# EAGLE design sound-board (EAGLE 8.3.1)
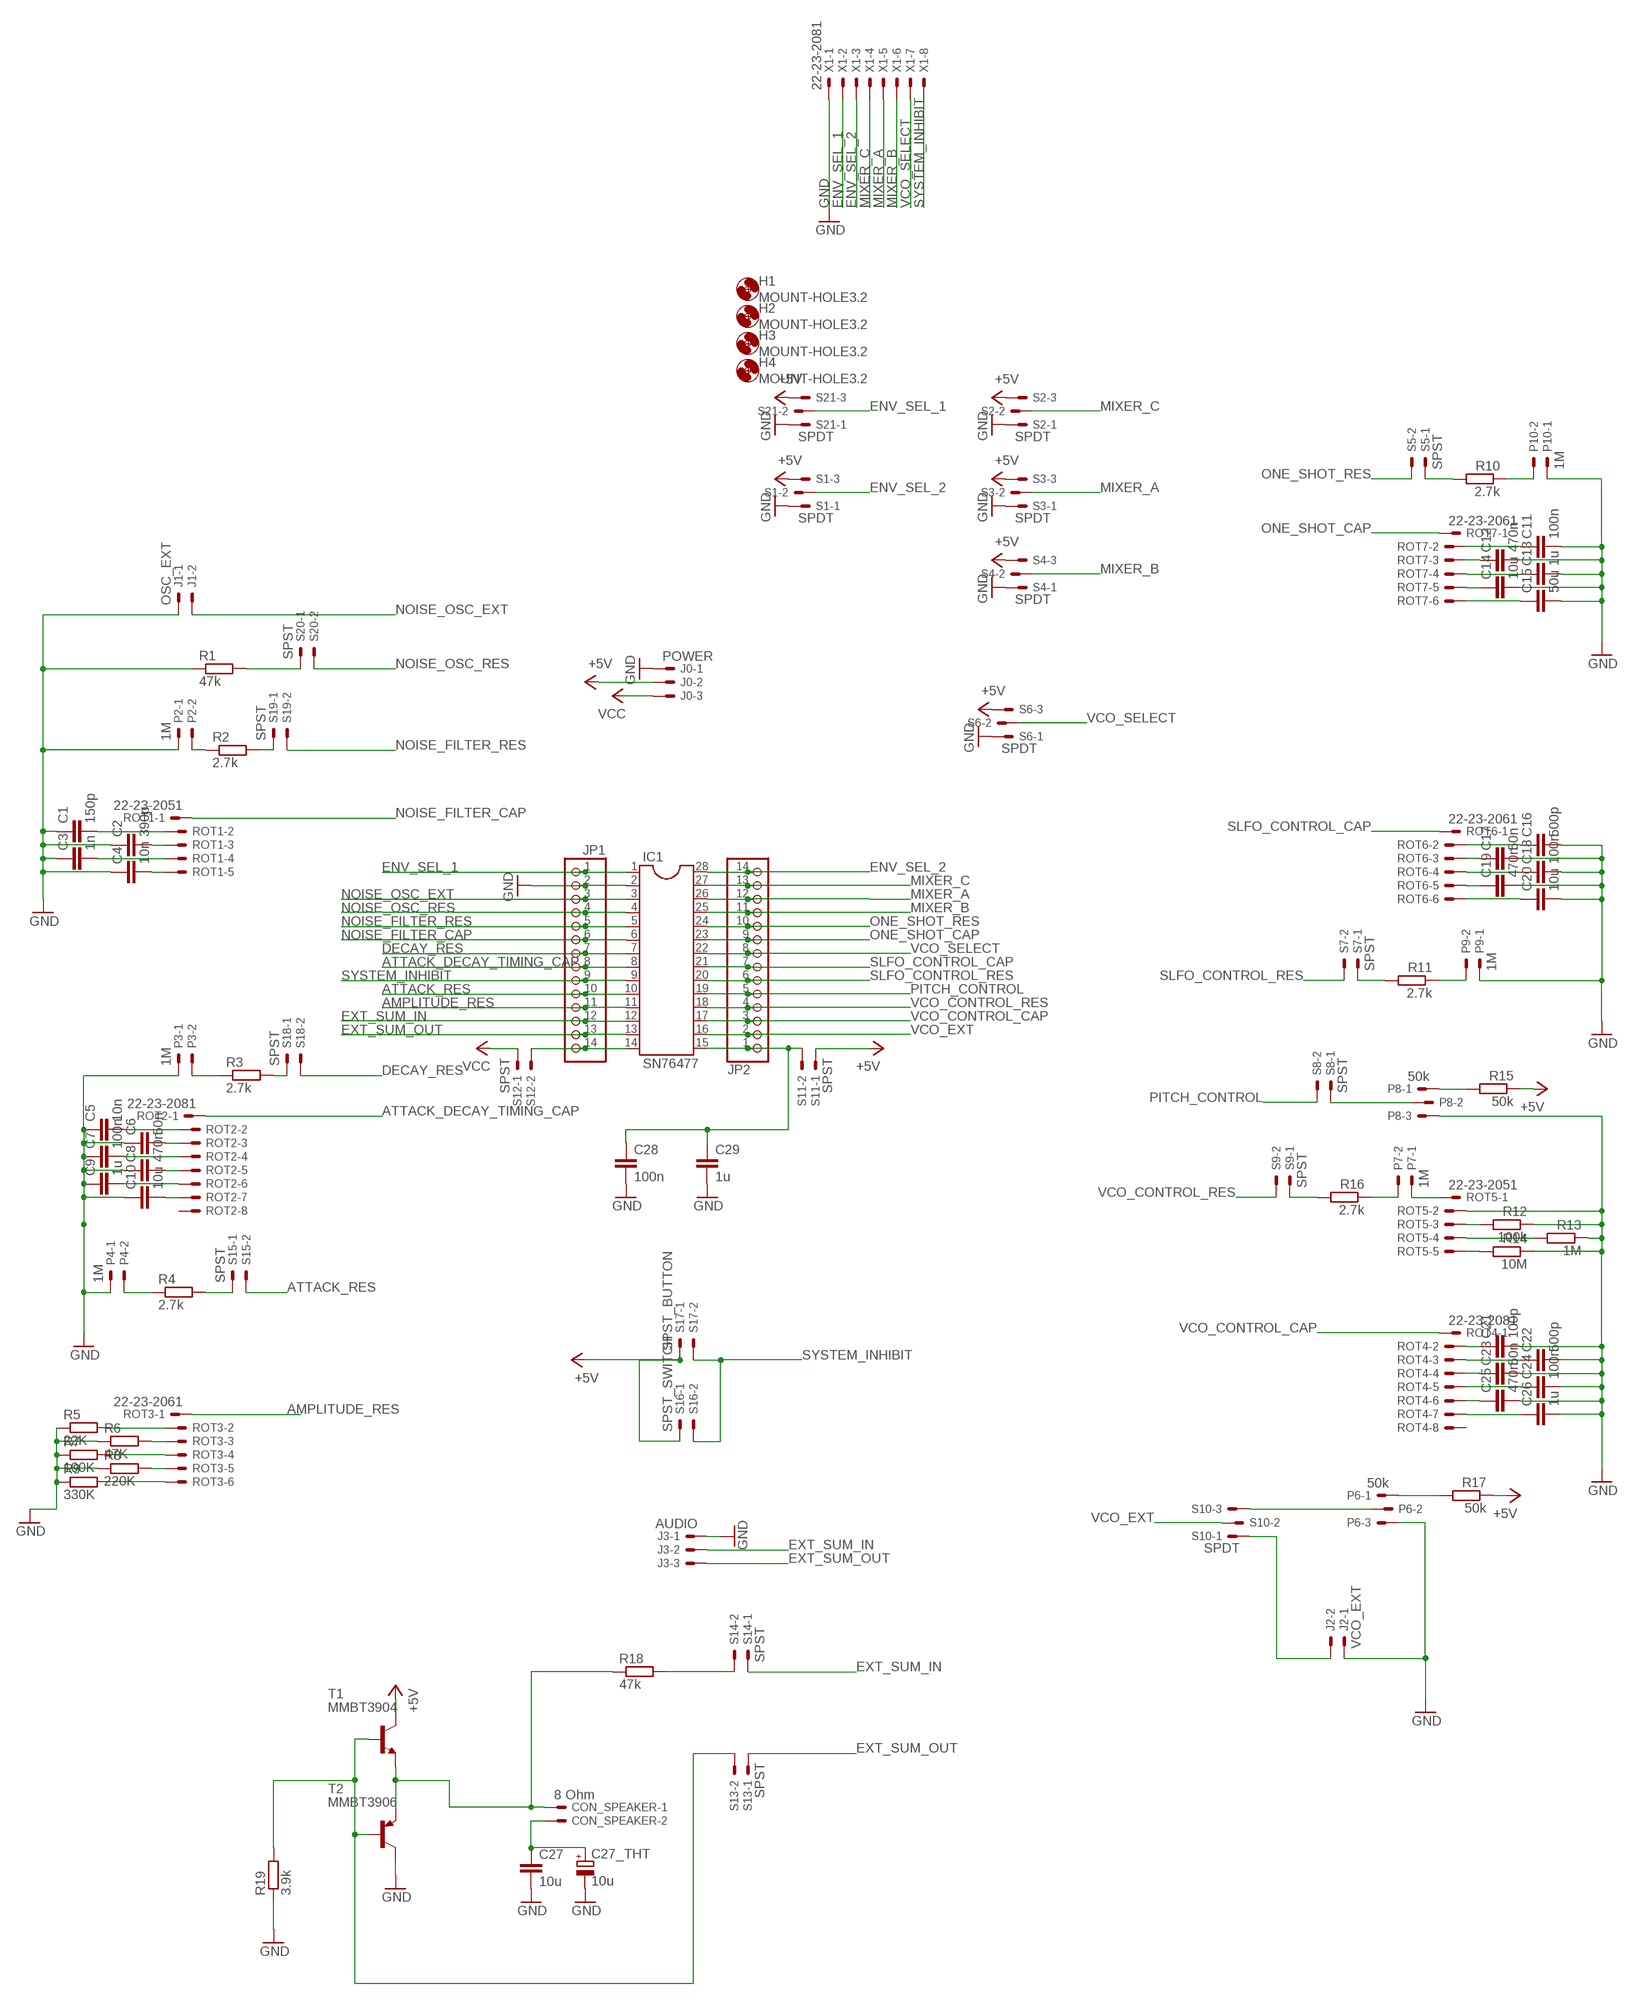
[diagram p0: schematic, sheet 1]

## Parts
C1  150p  C-EUC0805  [C0805]
C2  390p  C-EUC0805  [C0805]
C3  1n  C-EUC0805  [C0805]
C4  10n  C-EUC0805  [C0805]
C5  10n  C-EUC0805  [C0805]
C6  50n  C-EUC0805  [C0805]
C7  100n  C-EUC0805  [C0805]
C8  470n  C-EUC0805  [C0805]
C9  1u  C-EUC0805  [C0805]
C10  10u  C-EUC0805  [C0805]
C11  100n  C-EUC0805  [C0805]
C12  470n  C-EUC0805  [C0805]
C13  1u  C-EUC0805  [C0805]
C14  10u  C-EUC0805  [C0805]
C15  50u  C-EUC0805  [C0805]
C16  500p  C-EUC0805  [C0805]
C17  50n  C-EUC0805  [C0805]
C18  100n  C-EUC0805  [C0805]
C19  470n  C-EUC0805  [C0805]
C20  10u  C-EUC0805  [C0805]
C21  100p  C-EUC0805  [C0805]
C22  500p  C-EUC0805  [C0805]
C23  50n  C-EUC0805  [C0805]
C24  100n  C-EUC0805  [C0805]
C25  470n  C-EUC0805  [C0805]
C26  1u  C-EUC0805  [C0805]
C27  10u  C-EUC0805  [C0805]
C27_THT  10u  CPOL-EUE2.5-5  [E2,5-5]
C28  100n  C-EUC0805  [C0805]
C29  1u  C-EUC0805  [C0805]
CON_SPEAKER  8 Ohm  22-23-2021  [22-23-2021]
H1  MOUNT-HOLE3.2  [3,2]
H2  MOUNT-HOLE3.2  [3,2]
H3  MOUNT-HOLE3.2  [3,2]
H4  MOUNT-HOLE3.2  [3,2]
IC1  SN76477  DIL28  [DIL28-6]
J0  POWER  22-23-2031  [22-23-2031]
J1  OSC_EXT  22-23-2021  [22-23-2021]
J2  VCO_EXT  22-23-2021  [22-23-2021]
J3  AUDIO  22-23-2031  [22-23-2031]
JP1  PINHD-1X14  [1X14]
JP2  PINHD-1X14  [1X14]
P2  1M  22-23-2021  [22-23-2021]
P3  1M  22-23-2021  [22-23-2021]
P4  1M  22-23-2021  [22-23-2021]
P6  50k  22-23-2031  [22-23-2031]
P7  1M  22-23-2021  [22-23-2021]
P8  50k  22-23-2031  [22-23-2031]
P9  1M  22-23-2021  [22-23-2021]
P10  1M  22-23-2021  [22-23-2021]
R1  47k  R-EU_R0805  [R0805]
R2  2.7k  R-EU_R0805  [R0805]
R3  2.7k  R-EU_R0805  [R0805]
R4  2.7k  R-EU_R0805  [R0805]
R5  22K  R-EU_R0805  [R0805]
R6  47K  R-EU_R0805  [R0805]
R7  100K  R-EU_R0805  [R0805]
R8  220K  R-EU_R0805  [R0805]
R9  330K  R-EU_R0805  [R0805]
R10  2.7k  R-EU_R0805  [R0805]
R11  2.7k  R-EU_R0805  [R0805]
R12  100k  R-EU_R0805  [R0805]
R13  1M  R-EU_R0805  [R0805]
R14  10M  R-EU_R0805  [R0805]
R15  50k  R-EU_R0805  [R0805]
R16  2.7k  R-EU_R0805  [R0805]
R17  50k  R-EU_R0805  [R0805]
R18  47k  R-EU_R0805  [R0805]
R19  3.9k  R-EU_R0805  [R0805]
ROT1  22-23-2051  [22-23-2051]
ROT2  22-23-2081  [22-23-2081]
ROT3  22-23-2061  [22-23-2061]
ROT4  22-23-2081  [22-23-2081]
ROT5  22-23-2051  [22-23-2051]
ROT6  22-23-2061  [22-23-2061]
ROT7  22-23-2061  [22-23-2061]
S1  SPDT  22-23-2031  [22-23-2031]
S2  SPDT  22-23-2031  [22-23-2031]
S3  SPDT  22-23-2031  [22-23-2031]
S4  SPDT  22-23-2031  [22-23-2031]
S5  SPST  22-23-2021  [22-23-2021]
S6  SPDT  22-23-2031  [22-23-2031]
S7  SPST  22-23-2021  [22-23-2021]
S8  SPST  22-23-2021  [22-23-2021]
S9  SPST  22-23-2021  [22-23-2021]
S10  SPDT  22-23-2031  [22-23-2031]
S11  SPST  22-23-2021  [22-23-2021]
S12  SPST  22-23-2021  [22-23-2021]
S13  SPST  22-23-2021  [22-23-2021]
S14  SPST  22-23-2021  [22-23-2021]
S15  SPST  22-23-2021  [22-23-2021]
S16  SPST_SWITCH  22-23-2021  [22-23-2021]
S17  SPST_BUTTON  22-23-2021  [22-23-2021]
S18  SPST  22-23-2021  [22-23-2021]
S19  SPST  22-23-2021  [22-23-2021]
S20  SPST  22-23-2021  [22-23-2021]
S21  SPDT  22-23-2031  [22-23-2031]
T1  MMBT3904  MMBT3904LT1-NPN-SOT23-BEC  [SOT23-BEC]
T2  MMBT3906  MMBT3906LT1-PNP-SOT23-BEC  [SOT23-BEC]
X1  22-23-2081  [22-23-2081]

## Nets
+5V: J0.2 R15.1 R17.1 S1.3 S2.3 S3.3 S4.3 S6.3 S11.1 S16.1 S17.1 S21.3 T1.C
AMPLITUDE_RES: IC1.11 JP1.11 ROT3.1
ATTACK_DECAY_TIMING_CAP: IC1.8 JP1.8 ROT2.1
ATTACK_RES: IC1.10 JP1.10 S15.2
BASE: R19.2 S13.2 T1.B T2.B
DECAY_RES: IC1.7 JP1.7 S18.2
EMITTER: CON_SPEAKER.1 R18.1 T1.E T2.E
ENV_SEL_1: IC1.1 JP1.1 S21.2 X1.2
ENV_SEL_2: IC1.28 JP2.14 S1.2 X1.3
EXT_SUM_IN: IC1.12 J3.2 JP1.12 S14.1
EXT_SUM_OUT: IC1.13 J3.3 JP1.13 S13.1
GND: C1.1 C2.1 C3.1 C4.1 C5.1 C6.1 C7.1 C8.1 C9.1 C10.1 C11.2 C12.2 C13.2 C14.2 C15.2 C16.2 C17.2 C18.2 C19.2 C20.2 C21.2 C22.2 C23.2 C24.2 C25.2 C26.2 C27.2 C27_THT.- C28.2 C29.2 IC1.2 J0.1 J1.1 J2.1 J3.1 JP1.2 P2.1 P3.1 P4.1 P6.3 P8.3 P9.1 P10.1 R1.1 R5.1 R6.1 R7.1 R8.1 R9.1 R12.1 R13.1 R14.1 R19.1 ROT5.2 S1.1 S2.1 S3.1 S4.1 S6.1 S21.1 T2.C X1.1
MIXER_A: IC1.26 JP2.12 S3.2 X1.5
MIXER_B: IC1.25 JP2.11 S4.2 X1.6
MIXER_C: IC1.27 JP2.13 S2.2 X1.4
N$1: P10.2 R10.1
N$2: R2.2 S19.1
N$3: P3.2 R3.1
N$4: P2.2 R2.1
N$5: R1.2 S20.1
N$6: R5.2 ROT3.2
N$7: R6.2 ROT3.3
N$8: R7.2 ROT3.4
N$9: R8.2 ROT3.5
N$10: R10.2 S5.1
N$11: C16.1 ROT6.2
N$13: C27.1 C27_THT.+ CON_SPEAKER.2
N$14: IC1.14 JP1.14 S12.2
N$15: C11.1 ROT7.2
N$16: C13.1 ROT7.4
N$17: C15.1 ROT7.6
N$18: C14.1 ROT7.5
N$19: C18.1 ROT6.4
N$20: C20.1 ROT6.6
N$22: P9.2 R11.1
N$23: R12.2 ROT5.3
N$24: R14.2 ROT5.5
N$25: R13.2 ROT5.4
N$26: J2.2 S10.1
N$27: C21.1 ROT4.2
N$29: R9.2 ROT3.6
N$30: C1.2 ROT1.2
N$31: C2.2 ROT1.3
N$32: C3.2 ROT1.4
N$33: C4.2 ROT1.5
N$34: C5.2 ROT2.2
N$35: C6.2 ROT2.3
N$36: C7.2 ROT2.4
N$37: C8.2 ROT2.5
N$38: C9.2 ROT2.6
N$39: C10.2 ROT2.7
N$40: R3.2 S18.1
N$41: P4.2 R4.1
N$42: R4.2 S15.1
N$43: C12.1 ROT7.3
N$44: C19.1 ROT6.5
N$45: C17.1 ROT6.3
N$46: R11.2 S7.1
N$47: C23.1 ROT4.4
N$48: C25.1 ROT4.6
N$49: C26.1 ROT4.7
N$50: C24.1 ROT4.5
N$51: C22.1 ROT4.3
N$52: P8.2 S8.1
N$53: P8.1 R15.2
N$54: P7.2 R16.1
N$55: R16.2 S9.1
N$56: P7.1 ROT5.1
N$57: P6.2 S10.3
N$58: P6.1 R17.2
N$60: R18.2 S14.2
NOISE_FILTER_CAP: IC1.6 JP1.6 ROT1.1
NOISE_FILTER_RES: IC1.5 JP1.5 S19.2
NOISE_OSC_EXT: IC1.3 J1.2 JP1.3
NOISE_OSC_RES: IC1.4 JP1.4 S20.2
ONE_SHOT_CAP: IC1.23 JP2.9 ROT7.1
ONE_SHOT_RES: IC1.24 JP2.10 S5.2
PITCH_CONTROL: IC1.19 JP2.5 S8.2
SLFO_CONTROL_CAP: IC1.21 JP2.7 ROT6.1
SLFO_CONTROL_RES: IC1.20 JP2.6 S7.2
SYSTEM_INHIBIT: IC1.9 JP1.9 S16.2 S17.2 X1.8
VCC: J0.3 S12.1
VCO_CONTROL_CAP: IC1.17 JP2.3 ROT4.1
VCO_CONTROL_RES: IC1.18 JP2.4 S9.2
VCO_EXT: IC1.16 JP2.2 S10.2
VCO_SELECT: IC1.22 JP2.8 S6.2 X1.7
VREG: C28.1 C29.1 IC1.15 JP2.1 S11.2
Unconnected: ROT2.8 ROT4.8

## Library data of the parts
C1-C29 = rcl:C-EU: CAPACITOR, European symbol
C27_THT = rcl:CPOL-EU: POLARIZED CAPACITOR, European symbol
CON_SPEAKER J1 J2 P2-P4 P7 P9 P10 S5 S7-S9 S11-S20 = con-molex:22-23-2021: .100" (2.54mm) Center Header - 2 Pin; MF: MOLEX; MPN: 22-23-2021; OC_FARNELL: 1462926; OC_NEWARK: 25C3832
H1-H4 = holes:MOUNT-HOLE: MOUNTING HOLE with drill center marker
IC1 = ic-package:DIL28: Dual In Line
J0 J3 P6 P8 S1-S4 S6 S10 S21 = con-molex:22-23-2031: .100" (2.54mm) Center Header - 3 Pin; MF: MOLEX; MPN: 22-23-2031; OC_FARNELL: 1462950; OC_NEWARK: 30C0862
JP1 JP2 = pinhead:PINHD-1X14: PIN HEADER
R1-R19 = rcl:R-EU_: RESISTOR, European symbol
ROT1 ROT5 = con-molex:22-23-2051: .100" (2.54mm) Center Header - 5 Pin; MF: MOLEX; MPN: 22-23-2051; OC_FARNELL: 1462952; OC_NEWARK: 38C9178
ROT2 ROT4 X1 = con-molex:22-23-2081: .100" (2.54mm) Center Header - 8 Pin; MF: MOLEX; MPN: 22-23-2081; OC_FARNELL: 1756826; OC_NEWARK: 01C7592
ROT3 ROT6 ROT7 = con-molex:22-23-2061: .100" (2.54mm) Center Header - 6 Pin; MF: MOLEX; MPN: 22-23-2061; OC_FARNELL: 1462922; OC_NEWARK: 27C1933
T1 = transistor:*-NPN-: NPN Transistror BF959 corrected 2008.03.06
T2 = transistor:*-PNP-: PNP Transistror

## Module NOISE
Ports: NOISE_EXT_OSC(io) NOISE_OSC_RES(io) NOISE_FILTER_RES(io) NOISE_FILTER_CAP(io) GND(io)

### Library data of the parts

## Board
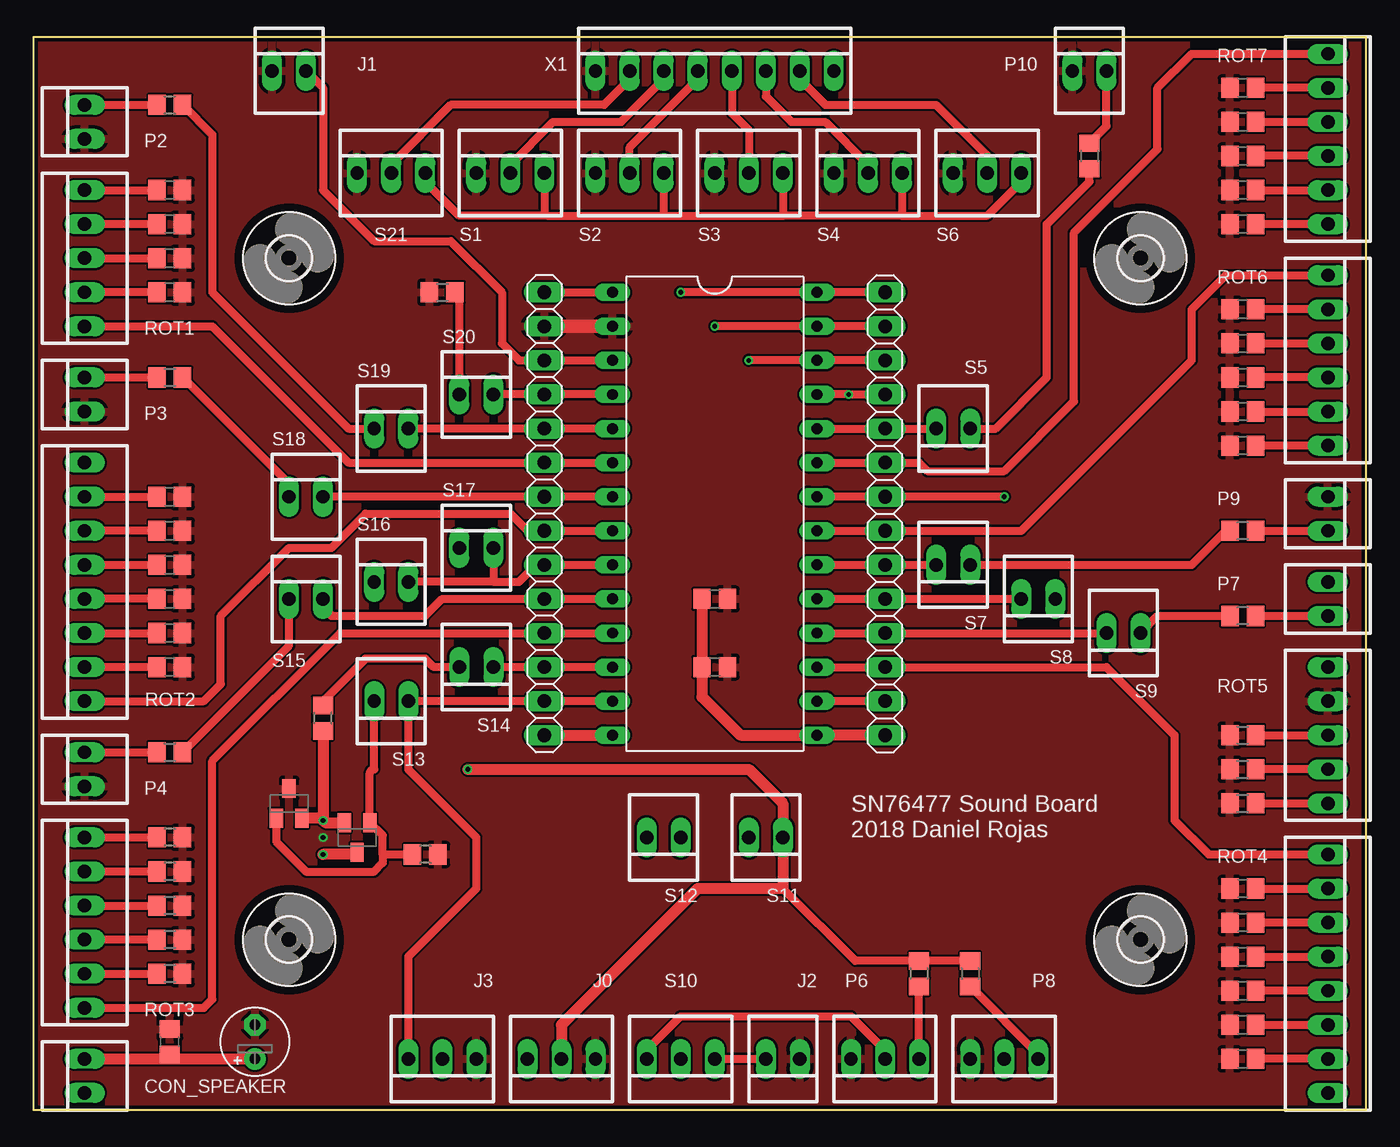
[diagram p1: board, top side]
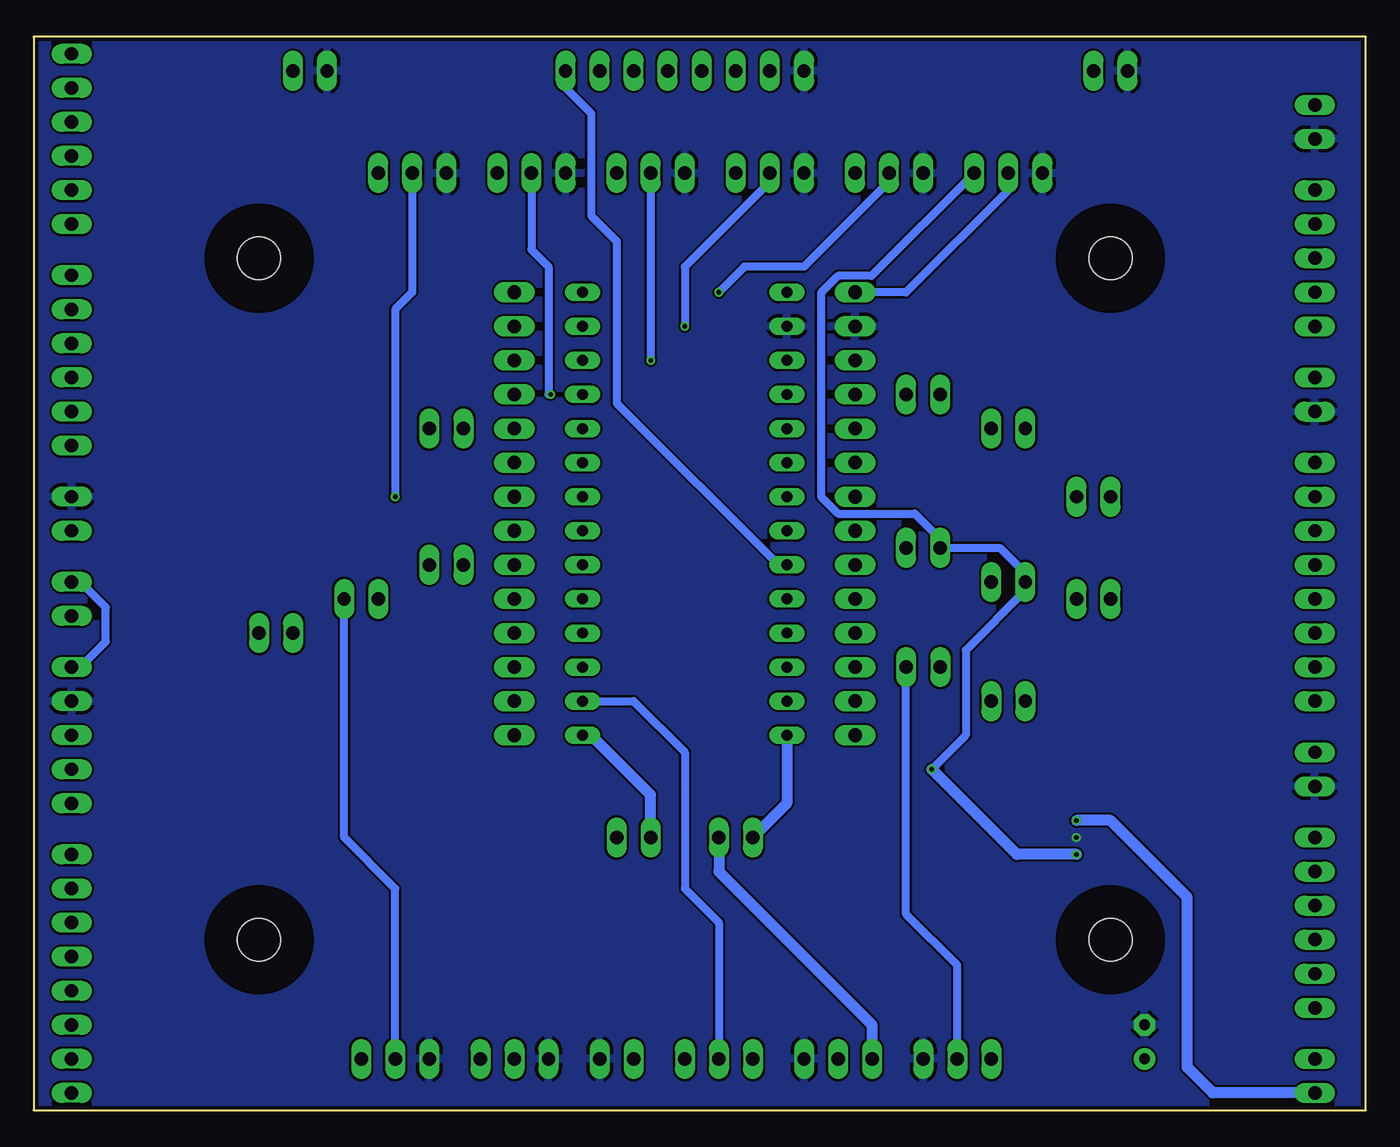
[diagram p2: board, bottom side, seen from below]

Size 99.36 x 80 mm. Coordinates in mm from the lower left corner, seen from the top.
Outline: 0,0 0,80 99.36,80 99.36,0 0,0
Copper layers (1*16): Top 0.035mm / dielectric 1.5mm / Bottom 0.035mm
Design rules "ITEADstudio_DRC": minimum track width 6mil, minimum drill 12mil, track to track 6mil, track to pad 6mil, pad to pad 6mil, via to via 6mil, smd to smd 0mil, copper to edge 10mil, drill to drill 10mil, minimum pad ring 10mil, minimum via ring 6mil, stop-mask expansion 2mil, vias tented up to drill 100mil, thermal gap 10mil

### Footprints (pad centres in the part's own frame; a part is rotated, then mirrored left to right if it is on the bottom)
C0805 = smd 1.3 x 1.5: 1 -0.95,0; 2 0.95,0
E2,5-5 = drill 0.813 pad 1.6: + -1.27,0 | drill 0.813 pad 1.6 octagon: - 1.27,0
22-23-2021 = drill 1 long: 1 -1.27,0; 2 1.27,0
3,2 = hole 3.2: 0,0
DIL28-6 = drill 0.813 long: 1 -16.51,-7.62; 2 -13.97,-7.62; 3 -11.43,-7.62; 4 -8.89,-7.62; 5 -6.35,-7.62; 6 -3.81,-7.62; 7 -1.27,-7.62; 8 1.27,-7.62; 9 3.81,-7.62; 10 6.35,-7.62; 11 8.89,-7.62; 12 11.43,-7.62; 13 13.97,-7.62; 14 16.51,-7.62; 15 16.51,7.62; 16 13.97,7.62; 17 11.43,7.62; 18 8.89,7.62; 19 6.35,7.62; 20 3.81,7.62; 21 1.27,7.62; 22 -1.27,7.62; 23 -3.81,7.62; 24 -6.35,7.62; 25 -8.89,7.62; 26 -11.43,7.62; 27 -13.97,7.62; 28 -16.51,7.62
22-23-2031 = drill 1 long: 1 -2.54,0; 2 0,0; 3 2.54,0
1X14 = drill 1.016 long: 1 -16.51,0; 2 -13.97,0; 3 -11.43,0; 4 -8.89,0; 5 -6.35,0; 6 -3.81,0; 7 -1.27,0; 8 1.27,0; 9 3.81,0; 10 6.35,0; 11 8.89,0; 12 11.43,0; 13 13.97,0; 14 16.51,0
R0805 = smd 1.3 x 1.5: 1 -0.95,0; 2 0.95,0
22-23-2051 = drill 1 long: 1 -5.08,0; 2 -2.54,0; 3 0,0; 4 2.54,0; 5 5.08,0
22-23-2081 = drill 1 long: 1 -8.89,0; 2 -6.35,0; 3 -3.81,0; 4 -1.27,0; 5 1.27,0; 6 3.81,0; 7 6.35,0; 8 8.89,0
22-23-2061 = drill 1 long: 1 -6.35,0; 2 -3.81,0; 3 -1.27,0; 4 1.27,0; 5 3.81,0; 6 6.35,0
SOT23-BEC = smd 1 x 1.4: B -0.95,-1.1; C 0,1.1; E 0.95,-1.1

### Placement (x,y rotation side)
C1  10.16,60.96 180 top
C2  10.16,63.5 180 top
C3  10.16,66.04 180 top
C4  10.16,68.58 180 top
C5  10.16,33.02 180 top
C6  10.16,35.56 180 top
C7  10.16,38.1 180 top
C8  10.16,40.64 180 top
C9  10.16,43.18 180 top
C10  10.16,45.72 180 top
C11  90.17,76.2 180 top
C12  90.17,73.66 180 top
C13  90.17,71.12 180 top
C14  90.17,68.58 180 top
C15  90.17,66.04 180 top
C16  90.17,59.69 180 top
C17  90.17,57.15 180 top
C18  90.17,54.61 180 top
C19  90.17,52.07 180 top
C20  90.17,49.53 180 top
C21  90.17,16.51 180 top
C22  90.17,13.97 180 top
C23  90.17,11.43 180 top
C24  90.17,8.89 180 top
C25  90.17,6.35 180 top
C26  90.17,3.81 180 top
C27  10.16,5.08 90 top
C27_THT  16.51,5.08 90 top
C28  50.8,38.1 0 top
C29  50.8,33.02 0 top
CON_SPEAKER  3.81,2.54 90 top
H1  19.05,63.5 0 top
H2  82.55,63.5 0 top
H3  19.05,12.7 0 top
H4  82.55,12.7 0 top
IC1  50.8,44.45 270 top
J0  39.37,3.81 180 top
J1  19.05,77.47 0 top
J2  55.88,3.81 180 top
J3  30.48,3.81 180 top
JP1  38.1,44.45 270 top
JP2  63.5,44.45 90 top
P2  3.81,73.66 90 top
P3  3.81,53.34 90 top
P4  3.81,25.4 90 top
P6  63.5,3.81 180 top
P7  96.52,38.1 270 top
P8  72.39,3.81 180 top
P9  96.52,44.45 270 top
P10  78.74,77.47 0 top
R1  30.48,60.96 0 top
R2  10.16,74.93 0 top
R3  10.16,54.61 0 top
R4  10.16,26.67 0 top
R5  10.16,10.16 180 top
R6  10.16,12.7 180 top
R7  10.16,15.24 180 top
R8  10.16,17.78 180 top
R9  10.16,20.32 180 top
R10  78.74,71.12 270 top
R11  90.17,43.18 180 top
R12  90.17,27.94 0 top
R13  90.17,25.4 0 top
R14  90.17,22.86 0 top
R15  69.85,10.16 270 top
R16  90.17,36.83 180 top
R17  66.04,10.16 270 top
R18  21.59,29.21 90 top
R19  29.21,19.05 180 top
ROT1  3.81,63.5 90 top
ROT2  3.81,39.37 90 top
ROT3  3.81,13.97 90 top
ROT4  96.52,10.16 270 top
ROT5  96.52,27.94 270 top
ROT6  96.52,55.88 270 top
ROT7  96.52,72.39 270 top
S1  35.56,69.85 0 top
S2  44.45,69.85 0 top
S3  53.34,69.85 0 top
S4  62.23,69.85 0 top
S5  68.58,50.8 180 top
S6  71.12,69.85 0 top
S7  68.58,40.64 180 top
S8  74.93,38.1 180 top
S9  81.28,35.56 180 top
S10  48.26,3.81 180 top
S11  54.61,20.32 180 top
S12  46.99,20.32 180 top
S13  26.67,30.48 180 top
S14  33.02,33.02 180 top
S15  20.32,38.1 0 top
S16  26.67,39.37 0 top
S17  33.02,41.91 0 top
S18  20.32,45.72 0 top
S19  26.67,50.8 0 top
S20  33.02,53.34 0 top
S21  26.67,69.85 0 top
T1  24.13,20.32 180 top
T2  19.05,22.86 0 top
X1  50.8,77.47 0 top

### Tracks (layer width: path | path; a pad name or v marks a point on that pad's centre or on a via)
+5V  (via drill 0.35)
  Top 0.61: S21.3 29.21,69.22 31.75,66.67 38.29,66.67 | 47.12,66.67 55.98,66.67 | 38.29,66.67 47.12,66.67 | 64.77,69.22 S4.3 64.77,66.75 64.7,66.67 | S3.3 55.88,66.78 55.98,66.67 | S2.3 46.99,66.81 47.12,66.67 | S1.3 38.1,66.87 38.29,66.67 | S6.3 73.66,69.22 71.12,66.67 64.7,66.67 | 64.7,66.67 55.98,66.67 | R15.1 R17.1 61.28,11.11 55.88,16.51 | T1.C 23.96,19.05
  Top 0.813: v32.38,25.4 53.34,25.4 55.88,22.86 S11.1 55.88,16.51 49.53,16.51 39.37,6.35 J0.2 | 23.96,19.05 v21.59,19.05
  Bottom 0.61: v32.38,25.4 29.84,27.94 29.84,34.29 25.4,38.73 S16.1 25.4,40.01 27.3,41.91 S17.1 31.75,42.55 33.66,44.45 39.37,44.45 40.64,45.72 40.64,60.91 39.37,62.18 36.88,62.18 S21.3
  Bottom 0.813: v21.59,19.05 26.04,19.05 v32.38,25.4
AMPLITUDE_RES
  Top 0.61: IC1.11 JP1.11 22.86,35.56 13.34,26.04 13.34,8.26 12.7,7.62 ROT3.1
ATTACK_DECAY_TIMING_CAP
  Top 0.61: IC1.8 JP1.8 36.83,43.18 35.56,44.45 24.77,44.45 22.23,41.91 19.05,41.91 13.97,36.83 13.97,31.75 12.7,30.48 ROT2.1
ATTACK_RES
  Top 0.61: 38.35,38.1 IC1.10 | 38.35,38.1 JP1.10 | S15.2 21.59,37.47 22.23,36.83 29.21,36.83 30.48,38.1 38.35,38.1
BASE
  Top 0.61: 18.1,21.91 T2.B 18.1,20 20.32,17.78 25.4,17.78 26.04,18.41 26.04,19.03 | S13.2 25.4,25.4 arc90 25.08,25.08 T1.B 26.04,20.46 26.04,19.03 | R19.2 28.24,19.03 26.04,19.03
DECAY_RES
  Top 0.61: IC1.7 JP1.7 S18.2
EMITTER  (via drill 0.35)
  Top 0.61: v21.59,21.59 21.76,21.42
  Top 0.813: T2.E 21.42,21.76 v21.59,21.59 R18.1 | 21.76,21.42 T1.E
  Bottom 0.813: CON_SPEAKER.1 11.43,1.27 13.34,3.17 13.34,15.88 19.05,21.59 v21.59,21.59
ENV_SEL_1
  Top 0.61: JP1.1 IC1.1 | X1.2 44.45,76.83 42.55,74.93 31.11,74.93 26.67,70.48 S21.2 26.67,69.22
  Bottom 0.61: S21.2 26.67,68.58 34.29,60.96 JP1.1
ENV_SEL_2  (via drill 0.35)
  Top 0.61: JP2.14 IC1.28 v48.26,60.96 | X1.3 46.99,76.83 43.81,73.66 38.73,73.66 35.56,70.48 S1.2 35.56,69.22
  Bottom 0.61: S1.2 35.56,69.22 41.91,62.87 46.35,62.87 v48.26,60.96
EXT_SUM_IN
  Top 0.61: IC1.12 JP1.12 S14.1
  Bottom 0.61: J3.2 30.48,10.79 34.29,14.61 S14.1
EXT_SUM_OUT
  Top 0.61: IC1.13 JP1.13 S13.1 27.94,25.4 33.02,20.32 33.02,16.51 27.94,11.43 J3.3
GND  (via drill 0.35)
  Top 1.016: IC1.2 JP1.2
  other vias: 21.59,20.32
  pour Top: 0,0 0,80.01 100.33,80.01 101.6,0
  pour Bottom: 0,0 0,80.01 100.33,80.01 99.06,0
MIXER_A  (via drill 0.35)
  Top 0.61: JP2.12 IC1.26 v53.34,55.88 | S3.2 53.34,73.03 52.07,74.3 X1.5
  Bottom 0.61: S3.2 v53.34,55.88
MIXER_B  (via drill 0.35)
  Top 0.61: JP2.11 v60.79,53.34 IC1.25 | S4.2 62.23,70.48 59.05,73.66 56.52,73.66 54.61,75.56 X1.6
  Bottom 0.61: S4.2 62.23,64.14 60.96,62.87 60.96,53.34 v60.79,53.34
MIXER_C  (via drill 0.35)
  Top 0.61: JP2.13 IC1.27 v50.8,58.42 | X1.4 49.53,76.83 44.45,71.75 S2.2
  Bottom 0.61: S2.2 arc29 44.45,69.22 50.8,62.87 v50.8,58.42
N$1
  Top 0.61: R10.1 80.01,73.34 P10.2
N$2
  Top 0.61: R2.2 13.34,72.7 13.34,60.96 23.5,50.8 S19.1
N$3
  Top 0.61: P3.2 R3.1
N$4
  Top 0.61: P2.2 R2.1
N$5
  Top 0.61: S20.1 31.75,60.96 R1.2
N$6
  Top 0.61: ROT3.2 R5.2
N$7
  Top 0.61: R6.2 ROT3.3
N$8
  Top 0.61: ROT3.4 R7.2
N$9
  Top 0.61: R8.2 ROT3.5
N$10
  Top 0.61: S5.1 71.75,50.8 75.56,54.61 75.56,66.04 78.74,69.22 R10.2
N$11
  Top 0.61: ROT6.2 C16.1
N$13
  Top 0.813: CON_SPEAKER.2 8.89,3.81 | 8.89,3.81 9.84,3.81 C27.1 | 8.89,3.81 C27_THT.+
N$14
  Top 0.813: JP1.14 IC1.14
  Bottom 0.813: IC1.14 43.18,22.86 S12.2
N$15
  Top 0.61: ROT7.2 C11.1
N$16
  Top 0.61: ROT7.4 C13.1
N$17
  Top 0.61: ROT7.6 C15.1
N$18
  Top 0.61: C14.1 ROT7.5
N$19
  Top 0.61: ROT6.4 C18.1
N$20
  Top 0.61: ROT6.6 C20.1
N$22
  Top 0.61: R11.1 P9.2
N$23
  Top 0.61: R12.2 ROT5.3
N$24
  Top 0.61: R14.2 ROT5.5
N$25
  Top 0.61: ROT5.4 R13.2
N$26
  Top 0.61: S10.1 J2.2
N$27
  Top 0.61: C21.1 ROT4.2
N$29
  Top 0.61: ROT3.6 R9.2
N$30
  Top 0.61: C1.2 ROT1.2
N$31
  Top 0.61: ROT1.3 C2.2
N$32
  Top 0.61: C3.2 ROT1.4
N$33
  Top 0.61: ROT1.5 C4.2
N$34
  Top 0.61: C5.2 ROT2.2
N$35
  Top 0.61: ROT2.3 C6.2
N$36
  Top 0.61: C7.2 ROT2.4
N$37
  Top 0.61: ROT2.5 C8.2
N$38
  Top 0.61: C9.2 ROT2.6
N$39
  Top 0.61: ROT2.7 C10.2
N$40
  Top 0.61: R3.2 19.05,46.67 S18.1
N$41
  Top 0.61: P4.2 R4.1
N$42
  Top 0.61: R4.2 19.05,34.61 S15.1
N$43
  Top 0.61: C12.1 ROT7.3
N$44
  Top 0.61: C19.1 ROT6.5
N$45
  Top 0.61: C17.1 ROT6.3
N$46
  Top 0.61: S7.1 86.36,40.64 88.9,43.18 R11.2
N$47
  Top 0.61: C23.1 ROT4.4
N$48
  Top 0.61: C25.1 ROT4.6
N$49
  Top 0.61: ROT4.7 C26.1
N$50
  Top 0.61: ROT4.5 C24.1
N$51
  Top 0.61: ROT4.3 C22.1
N$52
  Bottom 0.61: P8.2 72.39,16.51 76.2,20.32 S8.1
N$53
  Top 0.61: R15.2 74.93,4.13 P8.1
N$54
  Top 0.61: R16.1 P7.2
N$55
  Top 0.61: S9.1 83.82,36.83 R16.2
N$56
  Bottom 0.61: P7.1 95.89,39.37 93.98,37.47 93.98,34.92 95.89,33.02 ROT5.1
N$57
  Top 0.61: S10.3 45.72,4.45 48.26,6.99 60.96,6.99 63.5,4.45 P6.2
N$58
  Top 0.61: P6.1 R17.2
N$60
  Top 0.61: S14.2 29.84,33.02 29.21,33.66 24.77,33.66 21.59,30.48 R18.2
NOISE_FILTER_CAP
  Top 0.61: IC1.6 38.89,48.26 JP1.6 23.5,48.26 13.34,58.42 ROT1.1
NOISE_FILTER_RES
  Top 0.61: IC1.5 JP1.5 S19.2
NOISE_OSC_EXT
  Top 0.61: IC1.3 JP1.3 36.2,55.88 34.92,57.15 34.92,60.96 31.11,64.77 25.4,64.77 21.59,68.58 21.59,76.2 J1.2
NOISE_OSC_RES
  Top 0.61: IC1.4 JP1.4 S20.2
ONE_SHOT_CAP
  Top 0.61: IC1.23 JP2.9 66.04,48.26 66.67,47.62 72.39,47.62 77.6,52.83 77.6,65.41 83.82,71.63 83.82,76.2 86.36,78.74 ROT7.1
ONE_SHOT_RES
  Top 0.61: IC1.24 JP2.10 S5.2
PITCH_CONTROL
  Top 0.61: IC1.19 JP2.5 S8.2
SLFO_CONTROL_CAP
  Top 0.61: IC1.21 JP2.7 73.66,43.18 86.36,55.88 86.36,59.69 88.9,62.23 ROT6.1
SLFO_CONTROL_RES
  Top 0.61: IC1.20 JP2.6 S7.2
SYSTEM_INHIBIT
  Top 0.61: IC1.9 JP1.9 37.47,40.64 36.2,39.37 34.31,39.37 | 59.69,76.83 X1.8 | 34.31,39.37 S16.2 | S17.2 34.31,41.89 34.31,39.37
  Bottom 0.61: X1.8 59.69,76.2 57.78,74.3 57.78,66.67 55.88,64.77 55.88,52.7 43.81,40.64 IC1.9
VCC
  Bottom 0.813: S12.1 48.26,17.78 36.83,6.35 J0.3
VCO_CONTROL_CAP
  Top 0.61: IC1.17 JP2.3 80.01,33.02 85.09,27.94 85.09,21.59 87.63,19.05 ROT4.1
VCO_CONTROL_RES
  Top 0.61: IC1.18 JP2.4 S9.2
VCO_EXT
  Top 0.61: JP2.2 IC1.16
  Bottom 0.61: IC1.16 54.61,30.48 50.8,26.67 50.8,16.51 48.26,13.97 S10.2
VCO_SELECT  (via drill 0.35)
  Top 0.61: 63.28,45.72 JP2.8 | 63.28,45.72 IC1.22 | X1.7 57.15,76.83 59.05,74.93 67.31,74.93 71.12,71.12 S6.2 | v72.39,45.72 63.28,45.72
  Bottom 0.61: v72.39,45.72 72.39,59.69 71.12,60.96 S6.2
VREG
  Top 0.813: JP2.1 IC1.15 52.71,27.94 49.85,30.8 C29.1 C28.1
  Bottom 0.813: IC1.15 57.78,27.94 53.34,23.5 S11.2

### Text on the board
tNames: SN76477 Sound Board / 2018 Daniel Rojas